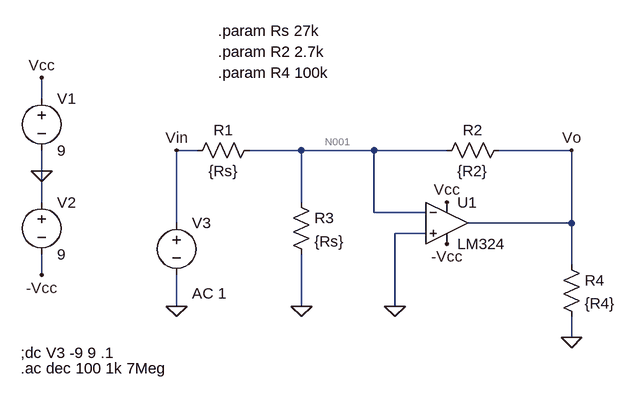
[diagram p0: schematic Inversor_Caso3.asc]
* Inversor_Caso3.asc
* U1: LM324 (symbol sympropio\LM324 not available, pins judged from their places): In+=0 In-=N001 V+=Vcc V-=-Vcc OUT=Vo
V1 Vcc 0 9
V2 0 -Vcc 9
V3 Vin 0 AC 1
R1 N001 Vin {Rs}
R3 N001 0 {Rs}
R2 Vo N001 {R2}
R4 Vo 0 {R4}
.param Rs 27k
.param R2 2.7k
.param R4 100k
;dc V3 -9 9 .1
.ac dec 100 1k 7Meg
.backanno
.end

* Results of the author's LTspice run, read from the files saved beside the schematic
* Operating Point, zero values left out:
*   V(vo) = -94.22 µV
*   V(-vcc) = -9 V
*   V(vcc) = 9 V
*   V(n001) = -33.65 µV
*   I(R4) = -942.2 pA
*   I(R2) = -22.43 nA
*   I(R3) = -1.246 nA
*   I(R1) = -1.246 nA
*   I(V3) = -1.246 nA
*   I(V2) = -603.8 µA
*   I(V1) = -603.9 µA
*   Ix(u1:1) = -19.92 nA
*   Ix(u1:2) = -19.94 nA
*   Ix(u1:3) = 603.9 µA
*   Ix(u1:4) = -603.8 µA
*   Ix(u1:5) = 23.38 nA
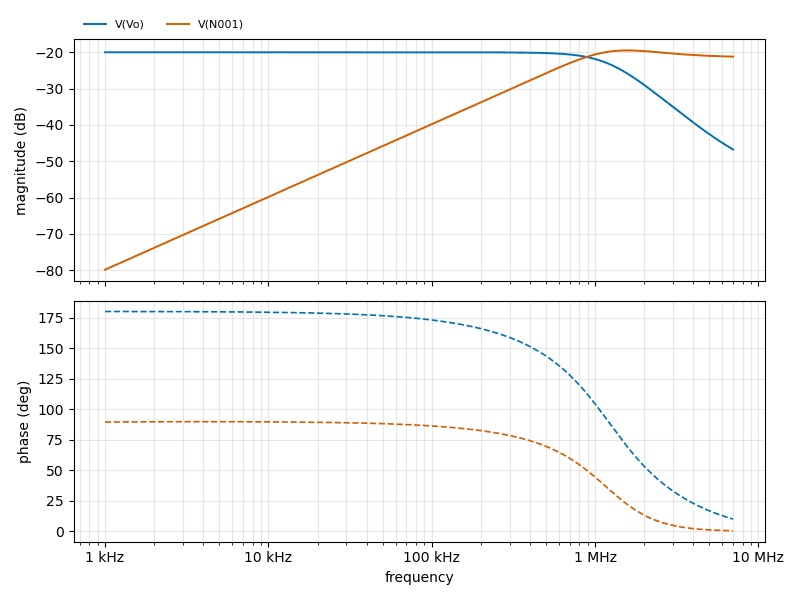
[diagram p1: AC Analysis of Inversor_Caso3.asc, plotted from the saved traces]
* AC Analysis, 1 run:
*   V(Vo): -20.00 dB at 1 kHz, -46.77 dB at 7 MHz, peak -20.00 dB at 1 kHz, 3 dB below the peak at 1.188 MHz
*   V(N001): -79.82 dB at 1 kHz, -21.20 dB at 7 MHz, peak -19.49 dB at 1.585 MHz, 3 dB below the peak at 745 kHz